# Altium schematic sheet PERIPHERAL_CON.SchDoc
size A; SheetNumber: 20; SheetTotal: 21
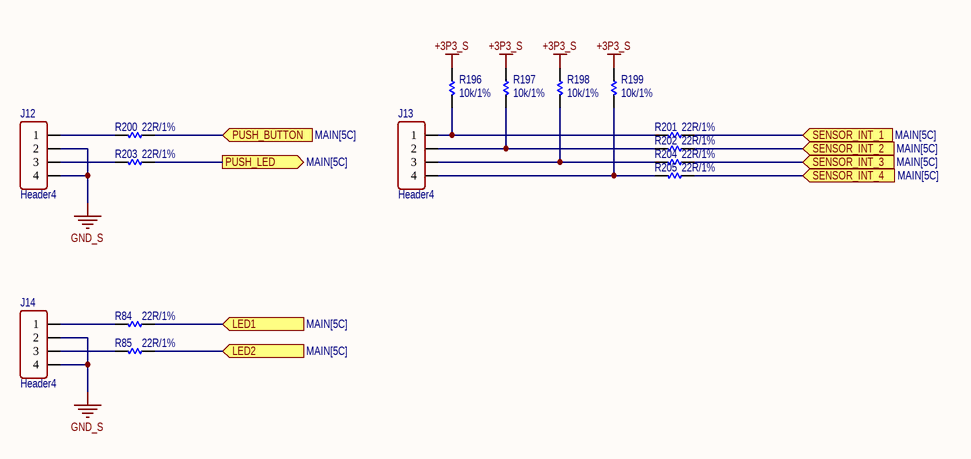
[diagram p0: PERIPHERAL_CON.SchDoc]

## Parts
J12  Header4  [XH2.54-4-DIP]
J13  Header4  [XH2.54-4-DIP]
J14  Header4  [XH2.54-4-DIP]
R84  22R/1%  [RES-SMD-0603]
R85  22R/1%  [RES-SMD-0603]
R196  10k/1%  [RES-SMD-0603]
R197  10k/1%  [RES-SMD-0603]
R198  10k/1%  [RES-SMD-0603]
R199  10k/1%  [RES-SMD-0603]
R200  22R/1%  [RES-SMD-0603]
R201  22R/1%  [RES-SMD-0603]
R202  22R/1%  [RES-SMD-0603]
R203  22R/1%  [RES-SMD-0603]
R204  22R/1%  [RES-SMD-0603]
R205  22R/1%  [RES-SMD-0603]

## Ports
LED1 (in, see MAIN[5C]), LED2 (in, see MAIN[5C]), PUSH_BUTTON (in, see MAIN[5C]), PUSH_LED (out, see MAIN[5C]), SENSOR_INT_1 (in, see MAIN[5C]), SENSOR_INT_2 (in, see MAIN[5C]), SENSOR_INT_3 (in, see MAIN[5C]), SENSOR_INT_4 (in, see MAIN[5C])

## Nets
+3P3_S: R196.1 R197.1 R198.1 R199.1
GND_S: J12.2 J12.4 J14.2 J14.4
LED1: R84.1 ; port LED1
LED2: R85.1 ; port LED2
PUSH_BUTTON: R200.1 ; port PUSH_BUTTON
PUSH_LED: R203.1 ; port PUSH_LED
SENSOR_INT_1: R201.1 ; port SENSOR_INT_1
SENSOR_INT_2: R202.1 ; port SENSOR_INT_2
SENSOR_INT_3: R204.1 ; port SENSOR_INT_3
SENSOR_INT_4: R205.1 ; port SENSOR_INT_4
NetJ12_1: J12.1 R200.2
NetJ12_3: J12.3 R203.2
NetJ13_1: J13.1 R196.2 R201.2
NetJ13_2: J13.2 R197.2 R202.2
NetJ13_3: J13.3 R198.2 R204.2
NetJ13_4: J13.4 R199.2 R205.2
NetJ14_1: J14.1 R84.2
NetJ14_3: J14.3 R85.2

## Library data of the parts
J12-J14 = Header4: Connector 4; Manufacturer: W¨¹rth Elektronik eiSos GmbH; partNo: 613002143121; ComponentLink1 Description: Manufacturer; ComponentLink2 Description: Datasheet; NoPins: 02; Created Date: 29 March 2013; ComponentLink1URL: http://www.we-online.com; ComponentLink2URL: http://katalog.we-online.de/em/datasheet/6130xx143121.pdf; Created by: Karrer Zheng
R84 R85 R200-R205 = Res-SMD: ERJ-3EKF22R0V; PN: ERJ-3EKF22R0V
R196-R199 = Res-SMD: ERJ-3EKF1002V; Manufacturer: Generic Components; Class: Passive; PN: ERJ-3EKF1002V; Publisher: Altium Hobart Technology Centre